# EAGLE schematic CombinedBackplane01 (EAGLE 7.7.0)

## Sheet 1 of 5
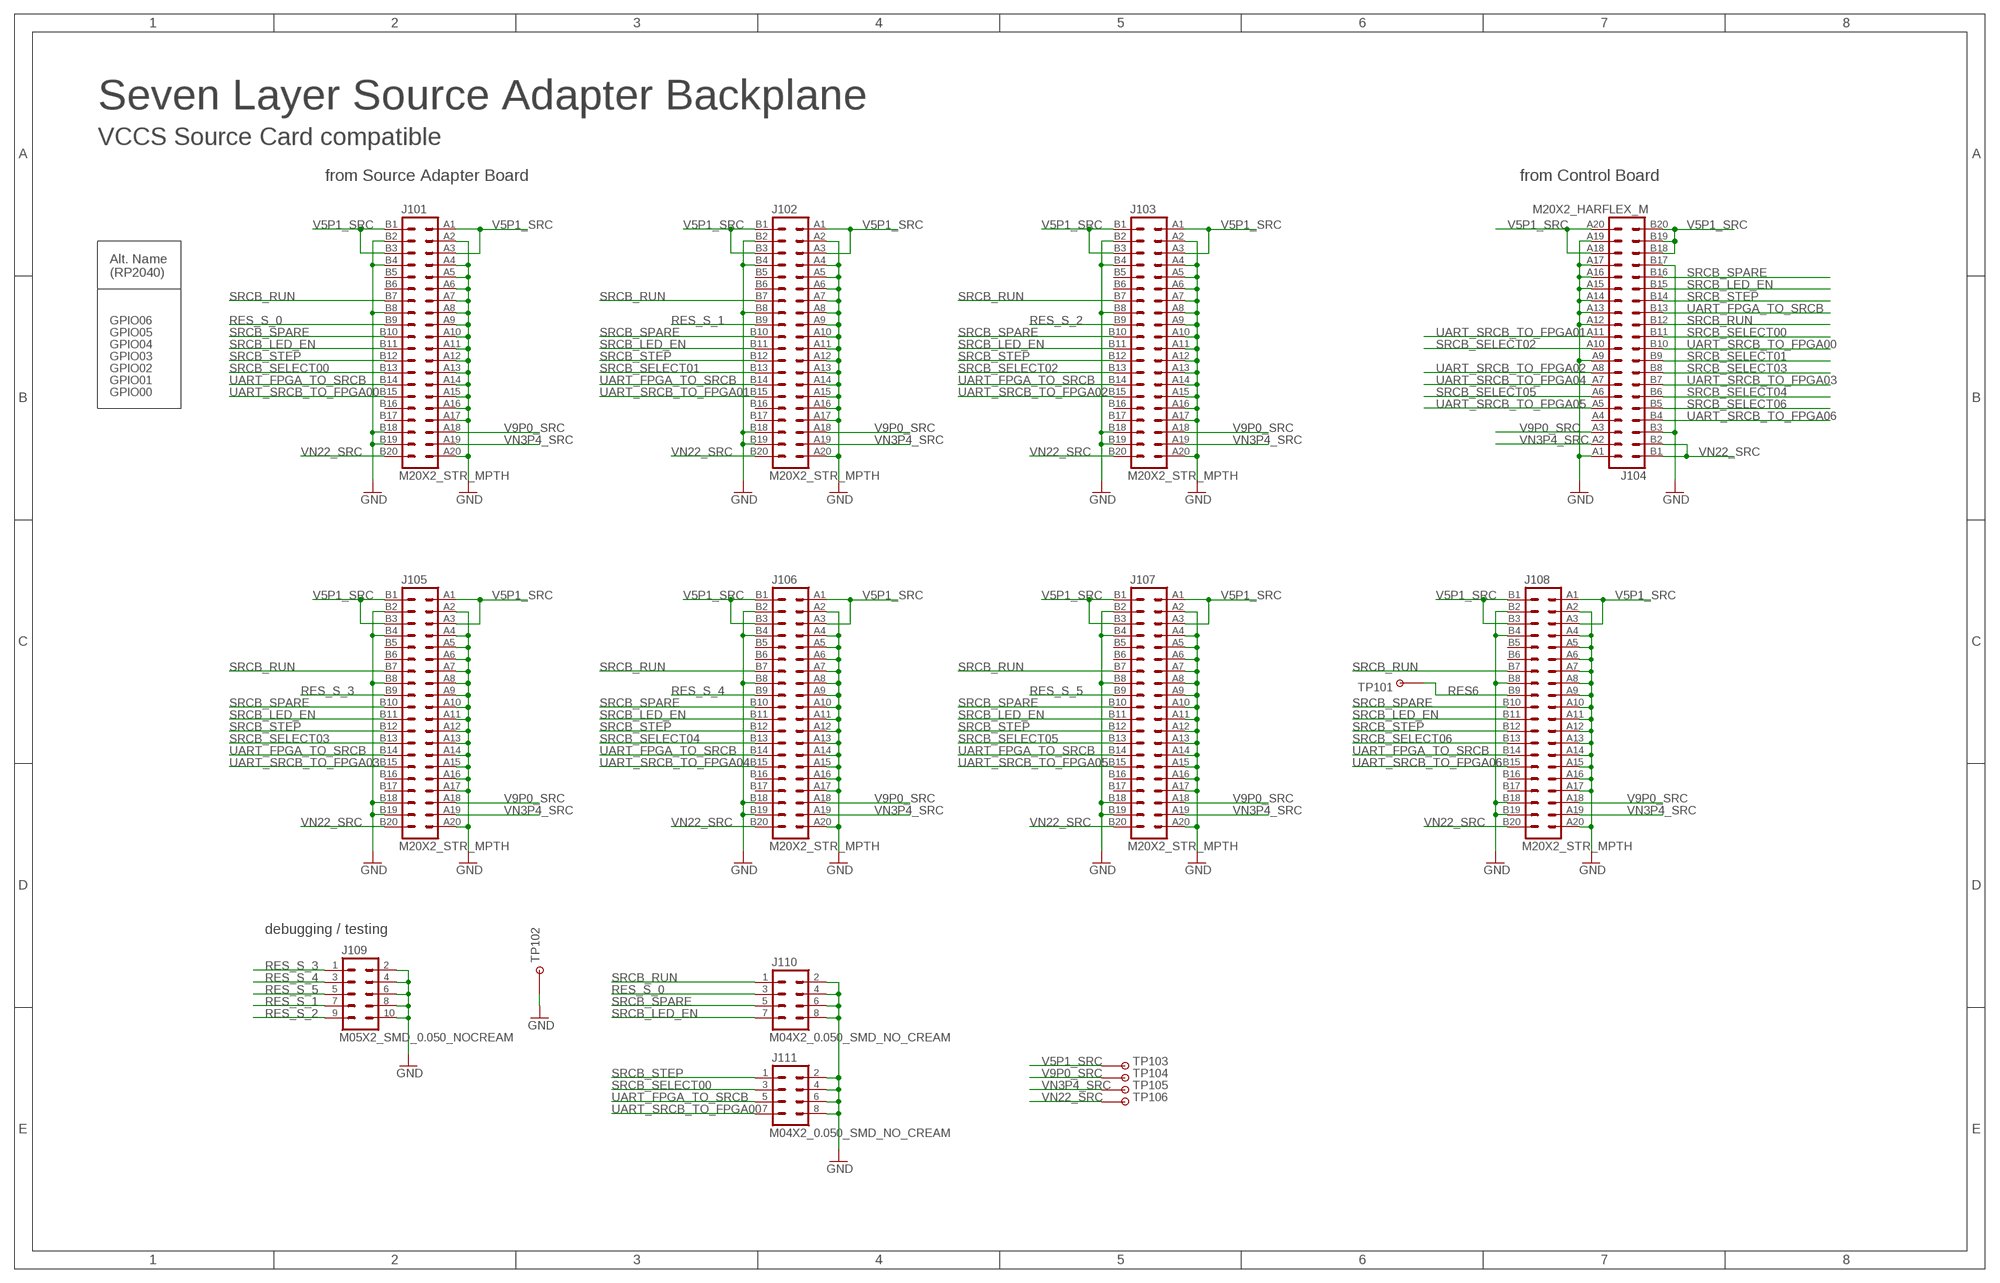
[diagram p0: schematic, sheet 1]

### Parts
J101  M20X2_STR_MPTH  [M20X2_HARFLEX_F_STR_MPTH]
J102  M20X2_STR_MPTH  [M20X2_HARFLEX_F_STR_MPTH]
J103  M20X2_STR_MPTH  [M20X2_HARFLEX_F_STR_MPTH]
J104  M20X2_HARFLEX_M  [M20X2_HARFLEX_M]
J105  M20X2_STR_MPTH  [M20X2_HARFLEX_F_STR_MPTH]
J106  M20X2_STR_MPTH  [M20X2_HARFLEX_F_STR_MPTH]
J107  M20X2_STR_MPTH  [M20X2_HARFLEX_F_STR_MPTH]
J108  M20X2_STR_MPTH  [M20X2_HARFLEX_F_STR_MPTH]
J109  M05X2_SMD_0.050_NOCREAM  [M05X2_0.050_SMD_NO_CREAM]
J110  M04X2_0.050_SMD_NO_CREAM  [M04X2_0.050_SMD_NO_CREAM]
J111  M04X2_0.050_SMD_NO_CREAM  [M04X2_0.050_SMD_NO_CREAM]
TP101  TESTPOINT_ROUND  [TESTPAD_ROUND]
TP102  TESTPOINTTUR  [TURRET]
TP103  TESTPOINT_ROUND  [TESTPAD_ROUND]
TP104  TESTPOINT_ROUND  [TESTPAD_ROUND]
TP105  TESTPOINT_ROUND  [TESTPAD_ROUND]
TP106  TESTPOINT_ROUND  [TESTPAD_ROUND]

### Nets
GND_SRC: J101.A2 J101.A4 J101.A5 J101.A6 J101.A7 J101.A8 J101.A9 J101.A10 J101.A11 J101.A12 J101.A13 J101.A14 J101.A15 J101.A16 J101.A17 J101.A20 J101.B2 J101.B4 J101.B8 J101.B18 J101.B19 J102.A2 J102.A4 J102.A5 J102.A6 J102.A7 J102.A8 J102.A9 J102.A10 J102.A11 J102.A12 J102.A13 J102.A14 J102.A15 J102.A16 J102.A17 J102.A20 J102.B2 J102.B4 J102.B8 J102.B18 J102.B19 J103.A2 J103.A4 J103.A5 J103.A6 J103.A7 J103.A8 J103.A9 J103.A10 J103.A11 J103.A12 J103.A13 J103.A14 J103.A15 J103.A16 J103.A17 J103.A20 J103.B2 J103.B4 J103.B8 J103.B18 J103.B19 J104.A1 J104.A9 J104.A12 J104.A13 J104.A14 J104.A15 J104.A16 J104.A17 J104.A19 J104.B3 J104.B17 J105.A2 J105.A4 J105.A5 J105.A6 J105.A7 J105.A8 J105.A9 J105.A10 J105.A11 J105.A12 J105.A13 J105.A14 J105.A15 J105.A16 J105.A17 J105.A20 J105.B2 J105.B4 J105.B8 J105.B18 J105.B19 J106.A2 J106.A4 J106.A5 J106.A6 J106.A7 J106.A8 J106.A9 J106.A10 J106.A11 J106.A12 J106.A13 J106.A14 J106.A15 J106.A16 J106.A17 J106.A20 J106.B2 J106.B4 J106.B8 J106.B18 J106.B19 J107.A2 J107.A4 J107.A5 J107.A6 J107.A7 J107.A8 J107.A9 J107.A10 J107.A11 J107.A12 J107.A13 J107.A14 J107.A15 J107.A16 J107.A17 J107.A20 J107.B2 J107.B4 J107.B8 J107.B18 J107.B19 J108.A2 J108.A4 J108.A5 J108.A6 J108.A7 J108.A8 J108.A9 J108.A10 J108.A11 J108.A12 J108.A13 J108.A14 J108.A15 J108.A16 J108.A17 J108.A20 J108.B2 J108.B4 J108.B8 J108.B18 J108.B19 J109.2 J109.4 J109.6 J109.8 J109.10 J110.2 J110.4 J110.6 J110.8 J111.2 J111.4 J111.6 J111.8 TP102.P$1 ; supply symbol labelled GND
RES6: J108.B9 TP101.P$1
RES_S_0: J101.B9 J110.3
RES_S_1: J102.B9 J109.7
RES_S_2: J103.B9 J109.9
RES_S_3: J105.B9 J109.1
RES_S_4: J106.B9 J109.3
RES_S_5: J107.B9 J109.5
SRCB_LED_EN: J101.B11 J102.B11 J103.B11 J104.B15 J105.B11 J106.B11 J107.B11 J108.B11 J110.7
SRCB_RUN: J101.B7 J102.B7 J103.B7 J104.B12 J105.B7 J106.B7 J107.B7 J108.B7 J110.1
SRCB_SELECT00: J101.B13 J104.B11 J111.3
SRCB_SELECT01: J102.B13 J104.B9
SRCB_SELECT02: J103.B13 J104.A10
SRCB_SELECT03: J104.B8 J105.B13
SRCB_SELECT04: J104.B6 J106.B13
SRCB_SELECT05: J104.A6 J107.B13
SRCB_SELECT06: J104.B5 J108.B13
SRCB_SPARE: J101.B10 J102.B10 J103.B10 J104.B16 J105.B10 J106.B10 J107.B10 J108.B10 J110.5
SRCB_STEP: J101.B12 J102.B12 J103.B12 J104.B14 J105.B12 J106.B12 J107.B12 J108.B12 J111.1
UART_FPGA_TO_SRCB: J101.B14 J102.B14 J103.B14 J104.B13 J105.B14 J106.B14 J107.B14 J108.B14 J111.5
UART_SRCB_TO_FPGA00: J101.B15 J104.B10 J111.7
UART_SRCB_TO_FPGA01: J102.B15 J104.A11
UART_SRCB_TO_FPGA02: J103.B15 J104.A8
UART_SRCB_TO_FPGA03: J104.B7 J105.B15
UART_SRCB_TO_FPGA04: J104.A7 J106.B15
UART_SRCB_TO_FPGA05: J104.A5 J107.B15
UART_SRCB_TO_FPGA06: J104.B4 J108.B15
V5P1_SRC: J101.A1 J101.A3 J101.B1 J101.B3 J102.A1 J102.A3 J102.B1 J102.B3 J103.A1 J103.A3 J103.B1 J103.B3 J104.A18 J104.A20 J104.B18 J104.B19 J104.B20 J105.A1 J105.A3 J105.B1 J105.B3 J106.A1 J106.A3 J106.B1 J106.B3 J107.A1 J107.A3 J107.B1 J107.B3 J108.A1 J108.A3 J108.B1 J108.B3 TP103.P$1
V9P0_SRC: J101.A18 J102.A18 J103.A18 J104.A3 J105.A18 J106.A18 J107.A18 J108.A18 TP104.P$1
VN3P4_SRC: J101.A19 J102.A19 J103.A19 J104.A2 J105.A19 J106.A19 J107.A19 J108.A19 TP105.P$1
VN22_SRC: J101.B20 J102.B20 J103.B20 J104.B1 J104.B2 J105.B20 J106.B20 J107.B20 J108.B20 TP106.P$1
Unconnected: J101.B5 J101.B6 J101.B16 J101.B17 J102.B5 J102.B6 J102.B16 J102.B17 J103.B5 J103.B6 J103.B16 J103.B17 J104.A4 J105.B5 J105.B6 J105.B16 J105.B17 J106.B5 J106.B6 J106.B16 J106.B17 J107.B5 J107.B6 J107.B16 J107.B17 J108.B5 J108.B6 J108.B16 J108.B17

### Notes on the sheet
- Seven Layer Source Adapter Backplane
- VCCS Source Card compatible
- from Source Adapter Board | from Control Board
- Alt. Name
  (RP2040)
- GPIO06
- GPIO05
- GPIO04
- GPIO03
- GPIO02
- GPIO01
- GPIO00
- debugging / testing

## Sheet 2 of 5
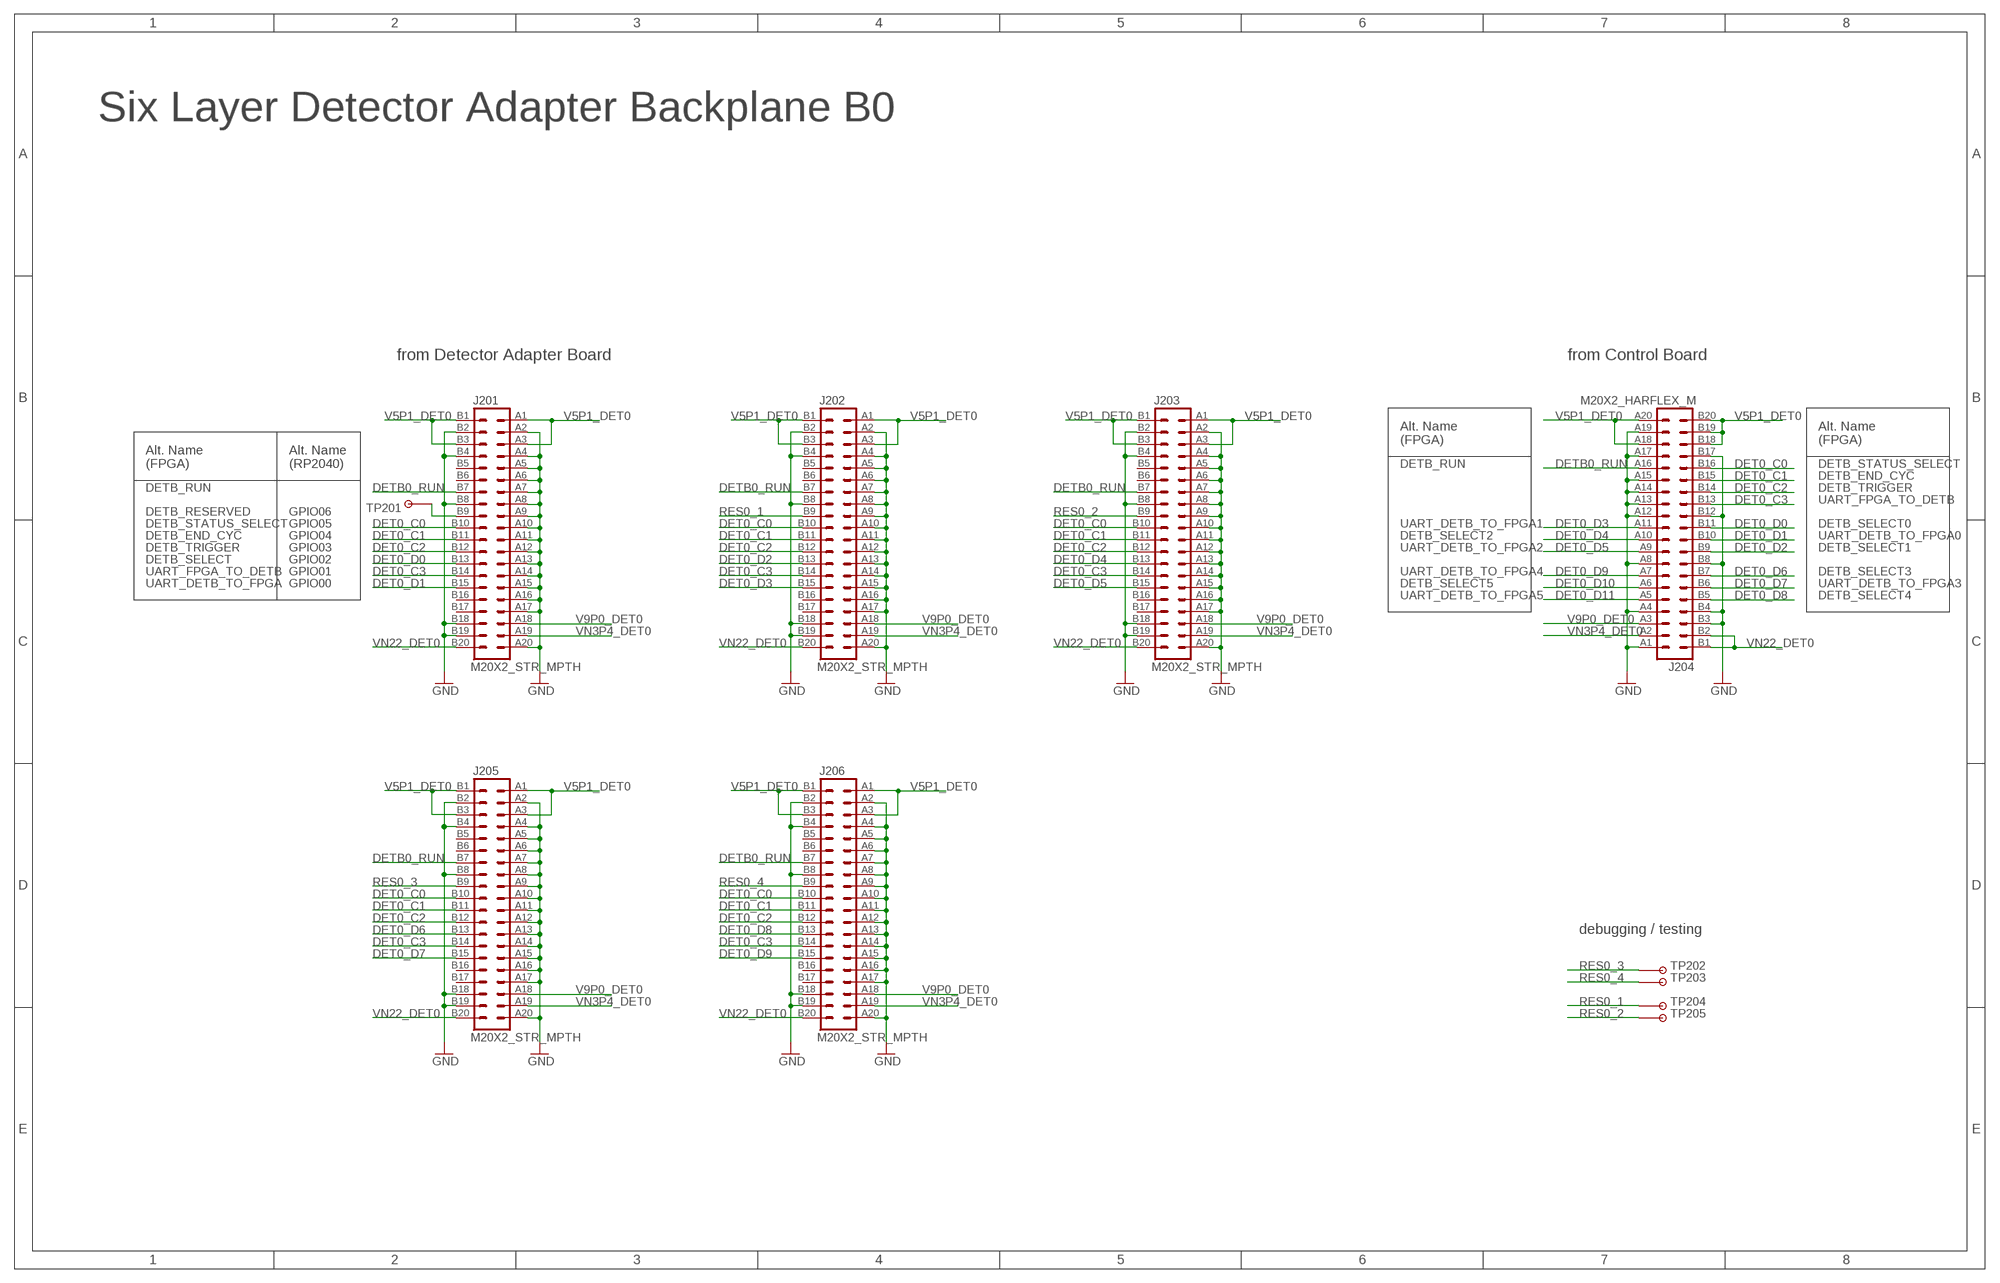
[diagram p1: schematic, sheet 2]

### Parts
J201  M20X2_STR_MPTH  [M20X2_HARFLEX_F_STR_MPTH]
J202  M20X2_STR_MPTH  [M20X2_HARFLEX_F_STR_MPTH]
J203  M20X2_STR_MPTH  [M20X2_HARFLEX_F_STR_MPTH]
J204  M20X2_HARFLEX_M  [M20X2_HARFLEX_M]
J205  M20X2_STR_MPTH  [M20X2_HARFLEX_F_STR_MPTH]
J206  M20X2_STR_MPTH  [M20X2_HARFLEX_F_STR_MPTH]
TP201  TESTPOINT_ROUND  [TESTPAD_ROUND]
TP202  TESTPOINT_ROUND  [TESTPAD_ROUND]
TP203  TESTPOINT_ROUND  [TESTPAD_ROUND]
TP204  TESTPOINT_ROUND  [TESTPAD_ROUND]
TP205  TESTPOINT_ROUND  [TESTPAD_ROUND]

### Nets
DET0_C0: J201.B10 J202.B10 J203.B10 J204.B16 J205.B10 J206.B10
DET0_C1: J201.B11 J202.B11 J203.B11 J204.B15 J205.B11 J206.B11
DET0_C2: J201.B12 J202.B12 J203.B12 J204.B14 J205.B12 J206.B12
DET0_C3: J201.B14 J202.B14 J203.B14 J204.B13 J205.B14 J206.B14
DET0_D0: J201.B13 J204.B11
DET0_D1: J201.B15 J204.B10
DET0_D2: J202.B13 J204.B9
DET0_D3: J202.B15 J204.A11
DET0_D4: J203.B13 J204.A10
DET0_D5: J203.B15 J204.A9
DET0_D6: J204.B7 J205.B13
DET0_D7: J204.B6 J205.B15
DET0_D8: J204.B5 J206.B13
DET0_D9: J204.A7 J206.B15
DET0_D10: J204.A6
DET0_D11: J204.A5
DETB0_RUN: J201.B7 J202.B7 J203.B7 J204.A16 J205.B7 J206.B7
GND: J201.A2 J201.A4 J201.A5 J201.A6 J201.A7 J201.A8 J201.A9 J201.A10 J201.A11 J201.A12 J201.A13 J201.A14 J201.A15 J201.A16 J201.A17 J201.A20 J201.B2 J201.B4 J201.B8 J201.B18 J201.B19 J202.A2 J202.A4 J202.A5 J202.A6 J202.A7 J202.A8 J202.A9 J202.A10 J202.A11 J202.A12 J202.A13 J202.A14 J202.A15 J202.A16 J202.A17 J202.A20 J202.B2 J202.B4 J202.B8 J202.B18 J202.B19 J203.A2 J203.A4 J203.A5 J203.A6 J203.A7 J203.A8 J203.A9 J203.A10 J203.A11 J203.A12 J203.A13 J203.A14 J203.A15 J203.A16 J203.A17 J203.A20 J203.B2 J203.B4 J203.B8 J203.B18 J203.B19 J204.A1 J204.A4 J204.A8 J204.A12 J204.A13 J204.A14 J204.A15 J204.A17 J204.A19 J204.B3 J204.B4 J204.B8 J204.B12 J204.B17 J205.A2 J205.A4 J205.A5 J205.A6 J205.A7 J205.A8 J205.A9 J205.A10 J205.A11 J205.A12 J205.A13 J205.A14 J205.A15 J205.A16 J205.A17 J205.A20 J205.B2 J205.B4 J205.B8 J205.B18 J205.B19 J206.A2 J206.A4 J206.A5 J206.A6 J206.A7 J206.A8 J206.A9 J206.A10 J206.A11 J206.A12 J206.A13 J206.A14 J206.A15 J206.A16 J206.A17 J206.A20 J206.B2 J206.B4 J206.B8 J206.B18 J206.B19 ; also sheet 3,4,5
N$2: J201.B9 TP201.P$1
RES0_1: J202.B9 TP204.P$1
RES0_2: J203.B9 TP205.P$1
RES0_3: J205.B9 TP202.P$1
RES0_4: J206.B9 TP203.P$1
V5P1_DET0: J201.A1 J201.A3 J201.B1 J201.B3 J202.A1 J202.A3 J202.B1 J202.B3 J203.A1 J203.A3 J203.B1 J203.B3 J204.A18 J204.A20 J204.B18 J204.B19 J204.B20 J205.A1 J205.A3 J205.B1 J205.B3 J206.A1 J206.A3 J206.B1 J206.B3
V9P0_DET0: J201.A18 J202.A18 J203.A18 J204.A3 J205.A18 J206.A18
VN3P4_DET0: J201.A19 J202.A19 J203.A19 J204.A2 J205.A19 J206.A19
VN22_DET0: J201.B20 J202.B20 J203.B20 J204.B1 J204.B2 J205.B20 J206.B20
Unconnected: J201.B5 J201.B6 J201.B16 J201.B17 J202.B5 J202.B6 J202.B16 J202.B17 J203.B5 J203.B6 J203.B16 J203.B17 J205.B5 J205.B6 J205.B16 J205.B17 J206.B5 J206.B6 J206.B16 J206.B17

### Notes on the sheet
- Six Layer Detector Adapter Backplane B0
- from Detector Adapter Board | from Control Board
- Alt. Name
  (FPGA)
- Alt. Name
  (FPGA)
- Alt. Name
  (FPGA)
- Alt. Name
  (RP2040)
- DETB_RUN | DETB_STATUS_SELECT
- DETB_END_CYC
- DETB_RUN | DETB_TRIGGER
- UART_FPGA_TO_DETB
- DETB_RESERVED | GPIO06
- DETB_STATUS_SELECT | GPIO05 | UART_DETB_TO_FPGA1 | DETB_SELECT0
- DETB_END_CYC | GPIO04 | DETB_SELECT2 | UART_DETB_TO_FPGA0
- DETB_TRIGGER | GPIO03 | UART_DETB_TO_FPGA2 | DETB_SELECT1
- DETB_SELECT | GPIO02
- UART_FPGA_TO_DETB | GPIO01 | UART_DETB_TO_FPGA4 | DETB_SELECT3
- UART_DETB_TO_FPGA | GPIO00 | DETB_SELECT5 | UART_DETB_TO_FPGA3
- UART_DETB_TO_FPGA5 | DETB_SELECT4
- debugging / testing

## Sheet 3 of 5
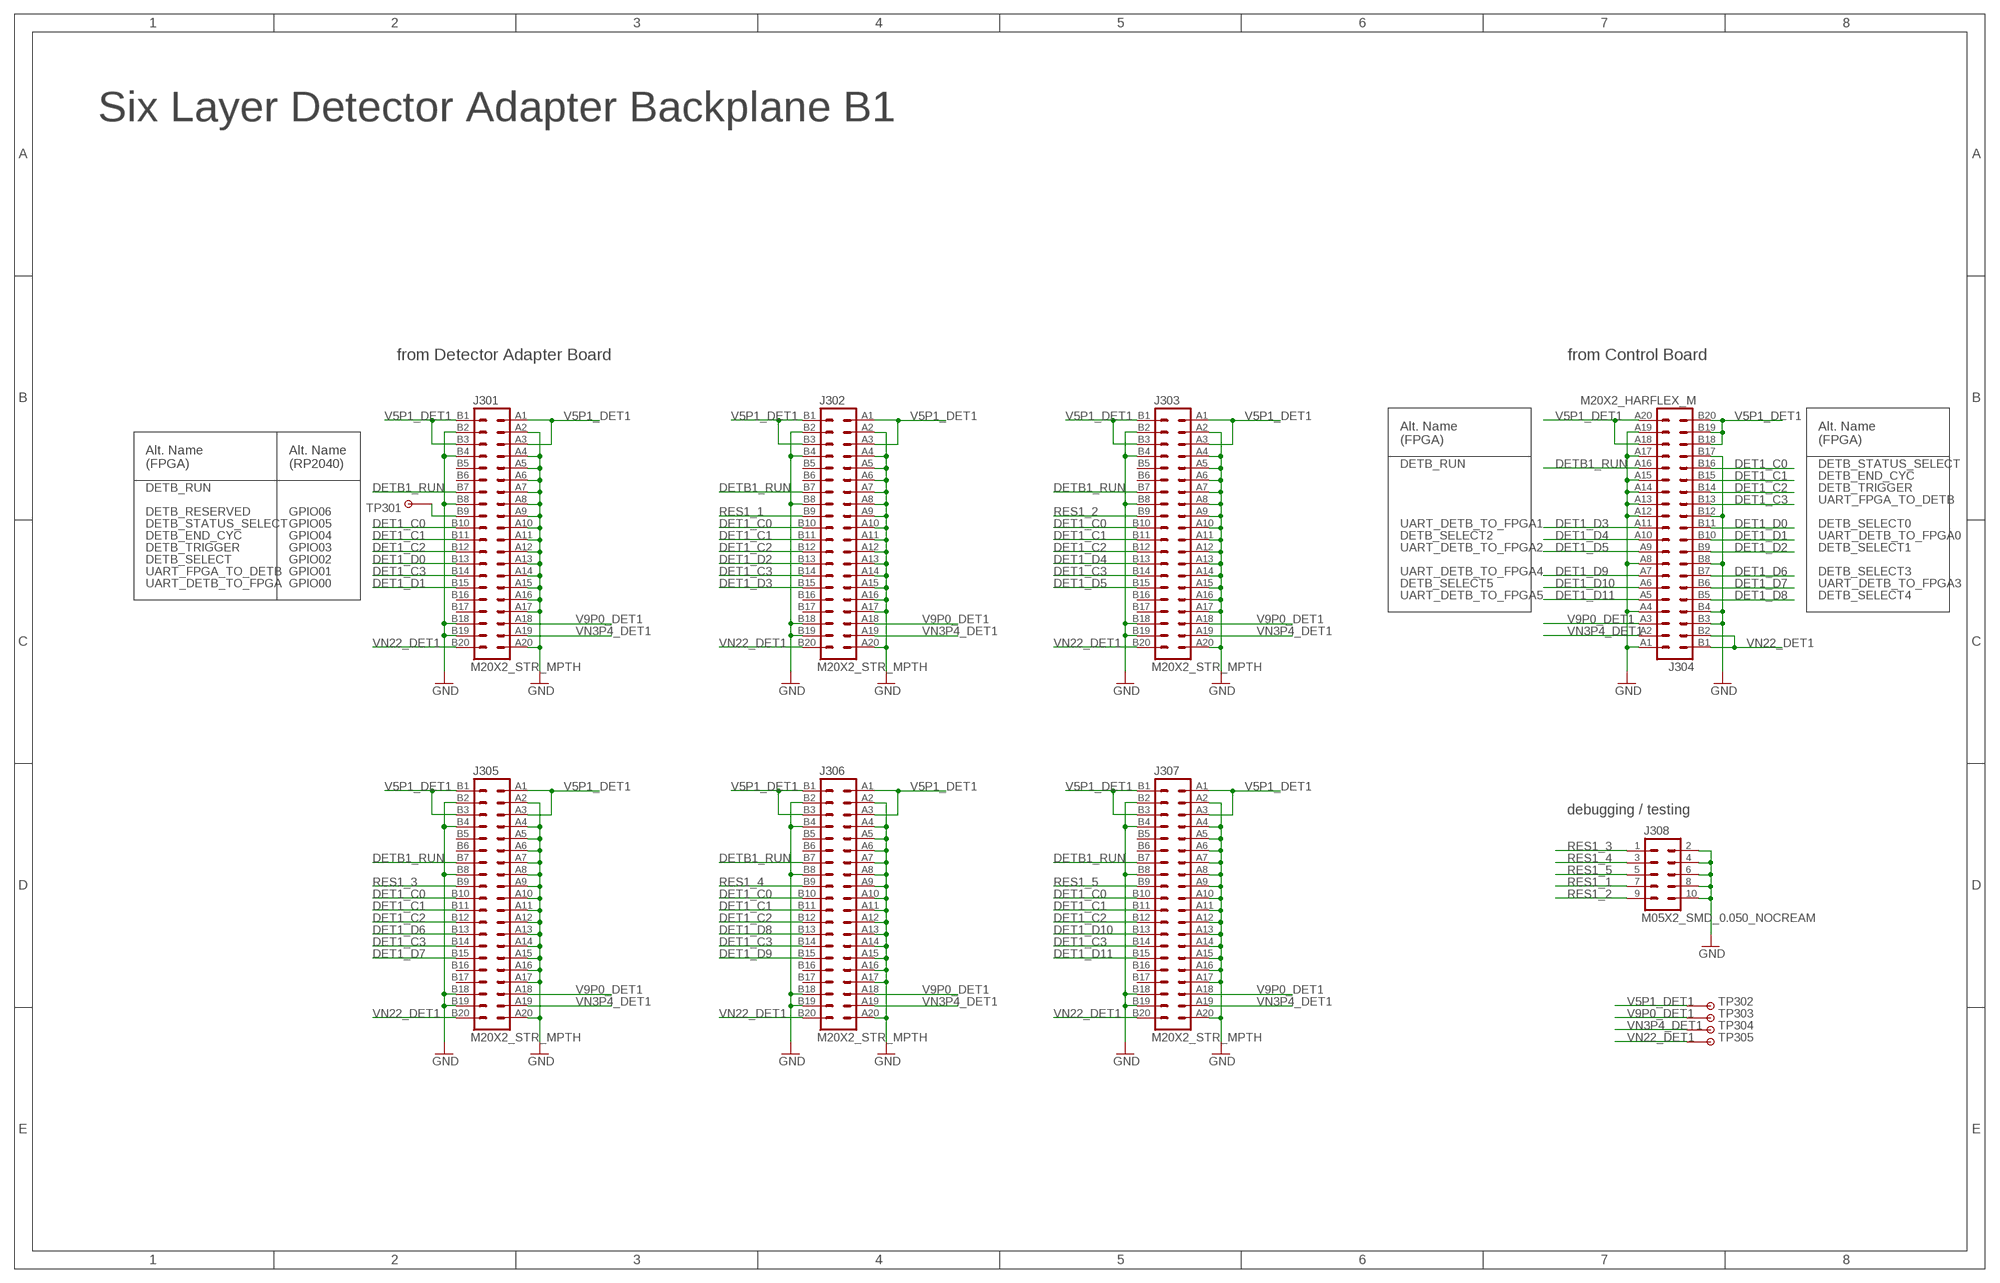
[diagram p2: schematic, sheet 3]

### Parts
J301  M20X2_STR_MPTH  [M20X2_HARFLEX_F_STR_MPTH]
J302  M20X2_STR_MPTH  [M20X2_HARFLEX_F_STR_MPTH]
J303  M20X2_STR_MPTH  [M20X2_HARFLEX_F_STR_MPTH]
J304  M20X2_HARFLEX_M  [M20X2_HARFLEX_M]
J305  M20X2_STR_MPTH  [M20X2_HARFLEX_F_STR_MPTH]
J306  M20X2_STR_MPTH  [M20X2_HARFLEX_F_STR_MPTH]
J307  M20X2_STR_MPTH  [M20X2_HARFLEX_F_STR_MPTH]
J308  M05X2_SMD_0.050_NOCREAM  [M05X2_0.050_SMD_NO_CREAM]
TP301  TESTPOINT_ROUND  [TESTPAD_ROUND]
TP302  TESTPOINT_ROUND  [TESTPAD_ROUND]
TP303  TESTPOINT_ROUND  [TESTPAD_ROUND]
TP304  TESTPOINT_ROUND  [TESTPAD_ROUND]
TP305  TESTPOINT_ROUND  [TESTPAD_ROUND]

### Nets
DET1_C0: J301.B10 J302.B10 J303.B10 J304.B16 J305.B10 J306.B10 J307.B10
DET1_C1: J301.B11 J302.B11 J303.B11 J304.B15 J305.B11 J306.B11 J307.B11
DET1_C2: J301.B12 J302.B12 J303.B12 J304.B14 J305.B12 J306.B12 J307.B12
DET1_C3: J301.B14 J302.B14 J303.B14 J304.B13 J305.B14 J306.B14 J307.B14
DET1_D0: J301.B13 J304.B11
DET1_D1: J301.B15 J304.B10
DET1_D2: J302.B13 J304.B9
DET1_D3: J302.B15 J304.A11
DET1_D4: J303.B13 J304.A10
DET1_D5: J303.B15 J304.A9
DET1_D6: J304.B7 J305.B13
DET1_D7: J304.B6 J305.B15
DET1_D8: J304.B5 J306.B13
DET1_D9: J304.A7 J306.B15
DET1_D10: J304.A6 J307.B13
DET1_D11: J304.A5 J307.B15
DETB1_RUN: J301.B7 J302.B7 J303.B7 J304.A16 J305.B7 J306.B7 J307.B7
GND: J301.A2 J301.A4 J301.A5 J301.A6 J301.A7 J301.A8 J301.A9 J301.A10 J301.A11 J301.A12 J301.A13 J301.A14 J301.A15 J301.A16 J301.A17 J301.A20 J301.B2 J301.B4 J301.B8 J301.B18 J301.B19 J302.A2 J302.A4 J302.A5 J302.A6 J302.A7 J302.A8 J302.A9 J302.A10 J302.A11 J302.A12 J302.A13 J302.A14 J302.A15 J302.A16 J302.A17 J302.A20 J302.B2 J302.B4 J302.B8 J302.B18 J302.B19 J303.A2 J303.A4 J303.A5 J303.A6 J303.A7 J303.A8 J303.A9 J303.A10 J303.A11 J303.A12 J303.A13 J303.A14 J303.A15 J303.A16 J303.A17 J303.A20 J303.B2 J303.B4 J303.B8 J303.B18 J303.B19 J304.A1 J304.A4 J304.A8 J304.A12 J304.A13 J304.A14 J304.A15 J304.A17 J304.A19 J304.B3 J304.B4 J304.B8 J304.B12 J304.B17 J305.A2 J305.A4 J305.A5 J305.A6 J305.A7 J305.A8 J305.A9 J305.A10 J305.A11 J305.A12 J305.A13 J305.A14 J305.A15 J305.A16 J305.A17 J305.A20 J305.B2 J305.B4 J305.B8 J305.B18 J305.B19 J306.A2 J306.A4 J306.A5 J306.A6 J306.A7 J306.A8 J306.A9 J306.A10 J306.A11 J306.A12 J306.A13 J306.A14 J306.A15 J306.A16 J306.A17 J306.A20 J306.B2 J306.B4 J306.B8 J306.B18 J306.B19 J307.A2 J307.A4 J307.A5 J307.A6 J307.A7 J307.A8 J307.A9 J307.A10 J307.A11 J307.A12 J307.A13 J307.A14 J307.A15 J307.A16 J307.A17 J307.A20 J307.B2 J307.B4 J307.B8 J307.B18 J307.B19 J308.2 J308.4 J308.6 J308.8 J308.10 ; also sheet 2,4,5
N$3: J301.B9 TP301.P$1
RES1_1: J302.B9 J308.7
RES1_2: J303.B9 J308.9
RES1_3: J305.B9 J308.1
RES1_4: J306.B9 J308.3
RES1_5: J307.B9 J308.5
V5P1_DET1: J301.A1 J301.A3 J301.B1 J301.B3 J302.A1 J302.A3 J302.B1 J302.B3 J303.A1 J303.A3 J303.B1 J303.B3 J304.A18 J304.A20 J304.B18 J304.B19 J304.B20 J305.A1 J305.A3 J305.B1 J305.B3 J306.A1 J306.A3 J306.B1 J306.B3 J307.A1 J307.A3 J307.B1 J307.B3 TP302.P$1
V9P0_DET1: J301.A18 J302.A18 J303.A18 J304.A3 J305.A18 J306.A18 J307.A18 TP303.P$1
VN3P4_DET1: J301.A19 J302.A19 J303.A19 J304.A2 J305.A19 J306.A19 J307.A19 TP304.P$1
VN22_DET1: J301.B20 J302.B20 J303.B20 J304.B1 J304.B2 J305.B20 J306.B20 J307.B20 TP305.P$1
Unconnected: J301.B5 J301.B6 J301.B16 J301.B17 J302.B5 J302.B6 J302.B16 J302.B17 J303.B5 J303.B6 J303.B16 J303.B17 J305.B5 J305.B6 J305.B16 J305.B17 J306.B5 J306.B6 J306.B16 J306.B17 J307.B5 J307.B6 J307.B16 J307.B17

### Notes on the sheet
- Six Layer Detector Adapter Backplane B1
- from Detector Adapter Board | from Control Board
- Alt. Name
  (FPGA)
- Alt. Name
  (FPGA)
- Alt. Name
  (FPGA)
- Alt. Name
  (RP2040)
- DETB_RUN | DETB_STATUS_SELECT
- DETB_END_CYC
- DETB_RUN | DETB_TRIGGER
- UART_FPGA_TO_DETB
- DETB_RESERVED | GPIO06
- DETB_STATUS_SELECT | GPIO05 | UART_DETB_TO_FPGA1 | DETB_SELECT0
- DETB_END_CYC | GPIO04 | DETB_SELECT2 | UART_DETB_TO_FPGA0
- DETB_TRIGGER | GPIO03 | UART_DETB_TO_FPGA2 | DETB_SELECT1
- DETB_SELECT | GPIO02
- UART_FPGA_TO_DETB | GPIO01 | UART_DETB_TO_FPGA4 | DETB_SELECT3
- UART_DETB_TO_FPGA | GPIO00 | DETB_SELECT5 | UART_DETB_TO_FPGA3
- UART_DETB_TO_FPGA5 | DETB_SELECT4
- debugging / testing

## Sheet 4 of 5
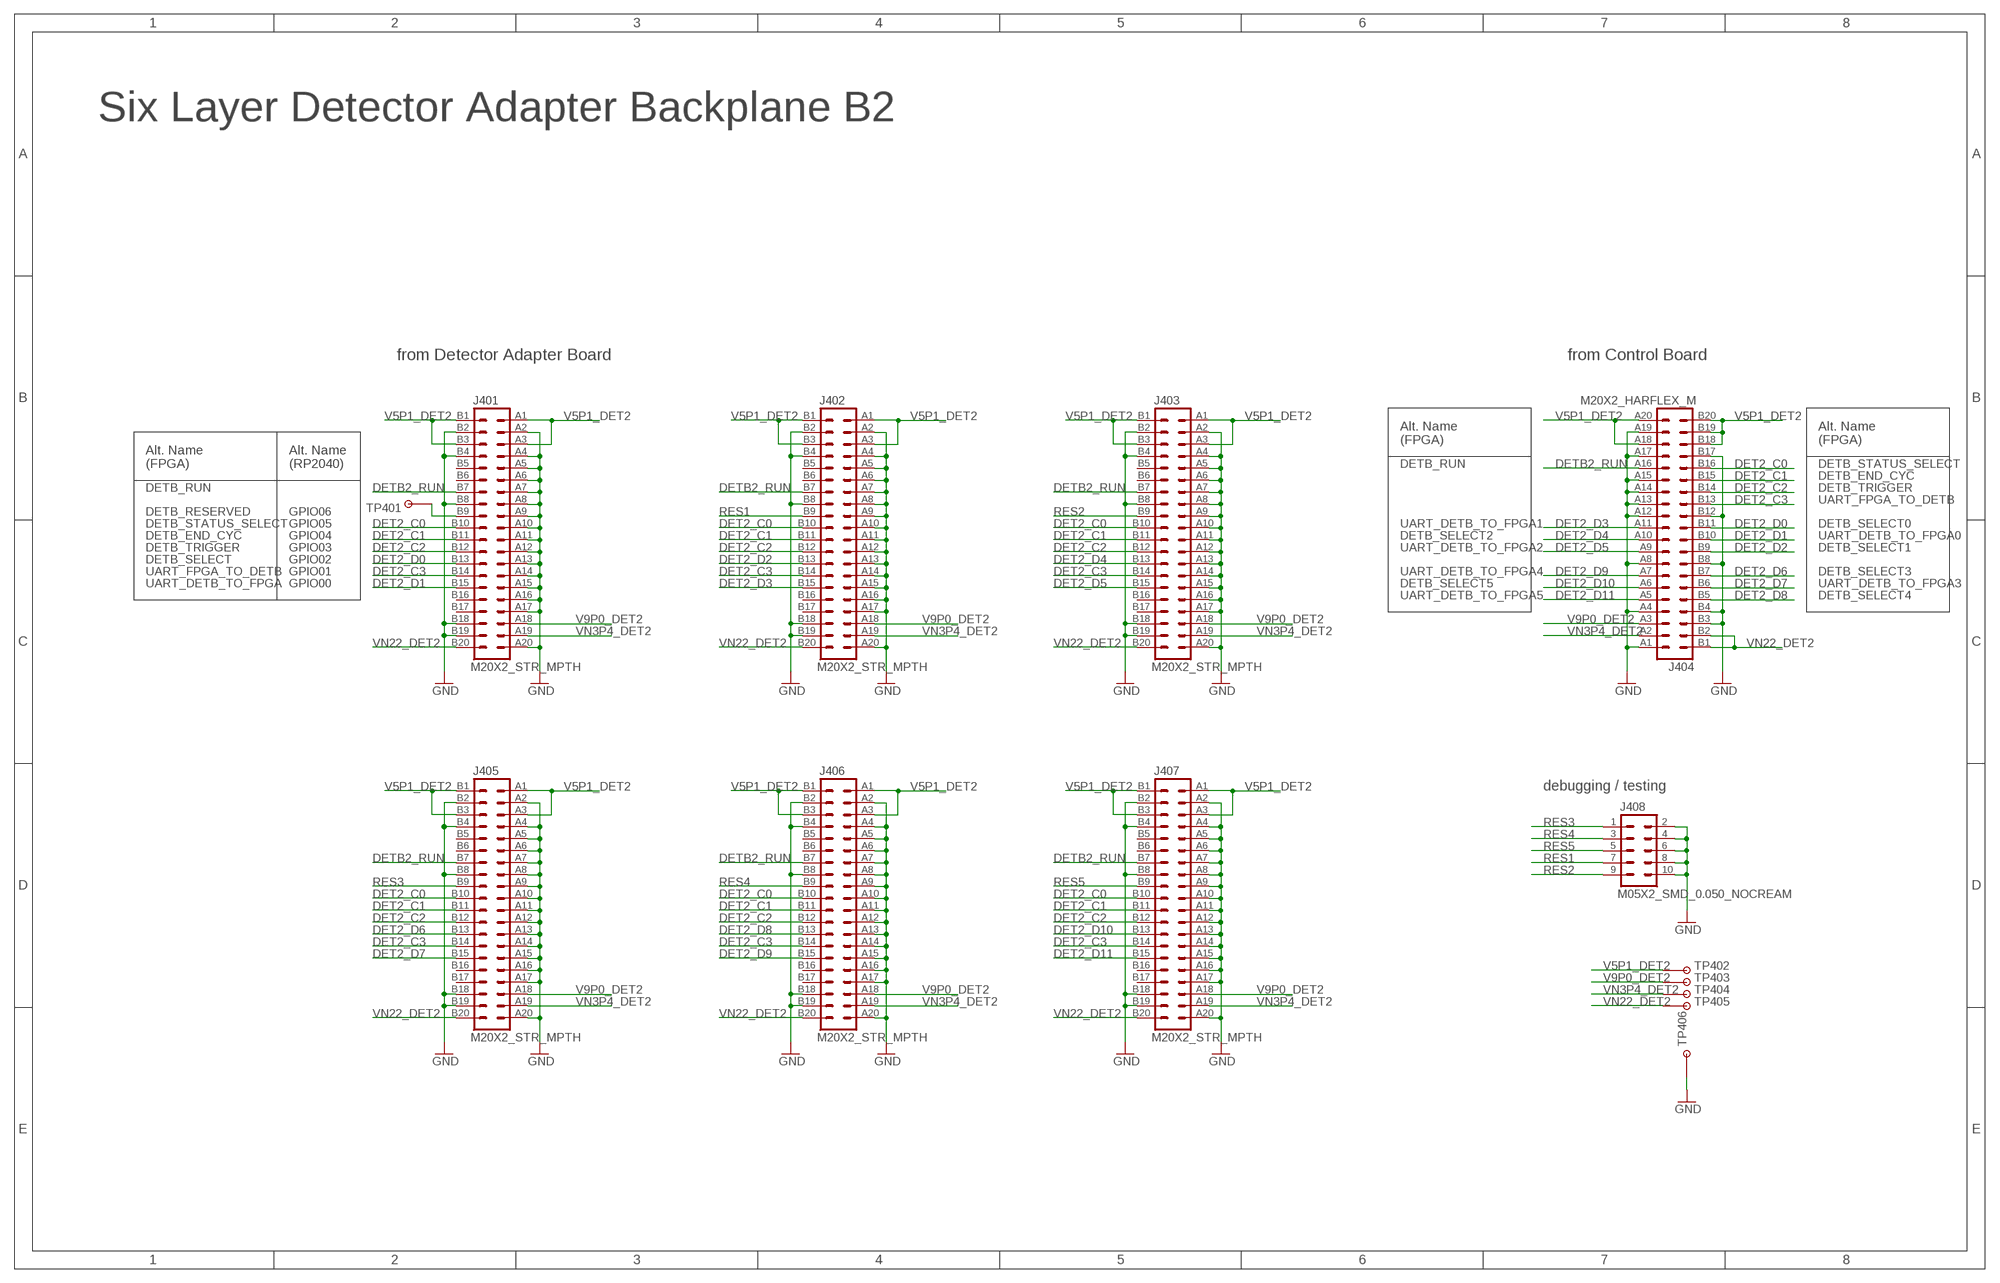
[diagram p3: schematic, sheet 4]

### Parts
J401  M20X2_STR_MPTH  [M20X2_HARFLEX_F_STR_MPTH]
J402  M20X2_STR_MPTH  [M20X2_HARFLEX_F_STR_MPTH]
J403  M20X2_STR_MPTH  [M20X2_HARFLEX_F_STR_MPTH]
J404  M20X2_HARFLEX_M  [M20X2_HARFLEX_M]
J405  M20X2_STR_MPTH  [M20X2_HARFLEX_F_STR_MPTH]
J406  M20X2_STR_MPTH  [M20X2_HARFLEX_F_STR_MPTH]
J407  M20X2_STR_MPTH  [M20X2_HARFLEX_F_STR_MPTH]
J408  M05X2_SMD_0.050_NOCREAM  [M05X2_0.050_SMD_NO_CREAM]
TP401  TESTPOINT_ROUND  [TESTPAD_ROUND]
TP402  TESTPOINT_ROUND  [TESTPAD_ROUND]
TP403  TESTPOINT_ROUND  [TESTPAD_ROUND]
TP404  TESTPOINT_ROUND  [TESTPAD_ROUND]
TP405  TESTPOINT_ROUND  [TESTPAD_ROUND]
TP406  TESTPOINTTUR  [TURRET]

### Nets
DET2_C0: J401.B10 J402.B10 J403.B10 J404.B16 J405.B10 J406.B10 J407.B10
DET2_C1: J401.B11 J402.B11 J403.B11 J404.B15 J405.B11 J406.B11 J407.B11
DET2_C2: J401.B12 J402.B12 J403.B12 J404.B14 J405.B12 J406.B12 J407.B12
DET2_C3: J401.B14 J402.B14 J403.B14 J404.B13 J405.B14 J406.B14 J407.B14
DET2_D0: J401.B13 J404.B11
DET2_D1: J401.B15 J404.B10
DET2_D2: J402.B13 J404.B9
DET2_D3: J402.B15 J404.A11
DET2_D4: J403.B13 J404.A10
DET2_D5: J403.B15 J404.A9
DET2_D6: J404.B7 J405.B13
DET2_D7: J404.B6 J405.B15
DET2_D8: J404.B5 J406.B13
DET2_D9: J404.A7 J406.B15
DET2_D10: J404.A6 J407.B13
DET2_D11: J404.A5 J407.B15
DETB2_RUN: J401.B7 J402.B7 J403.B7 J404.A16 J405.B7 J406.B7 J407.B7
GND: J401.A2 J401.A4 J401.A5 J401.A6 J401.A7 J401.A8 J401.A9 J401.A10 J401.A11 J401.A12 J401.A13 J401.A14 J401.A15 J401.A16 J401.A17 J401.A20 J401.B2 J401.B4 J401.B8 J401.B18 J401.B19 J402.A2 J402.A4 J402.A5 J402.A6 J402.A7 J402.A8 J402.A9 J402.A10 J402.A11 J402.A12 J402.A13 J402.A14 J402.A15 J402.A16 J402.A17 J402.A20 J402.B2 J402.B4 J402.B8 J402.B18 J402.B19 J403.A2 J403.A4 J403.A5 J403.A6 J403.A7 J403.A8 J403.A9 J403.A10 J403.A11 J403.A12 J403.A13 J403.A14 J403.A15 J403.A16 J403.A17 J403.A20 J403.B2 J403.B4 J403.B8 J403.B18 J403.B19 J404.A1 J404.A4 J404.A8 J404.A12 J404.A13 J404.A14 J404.A15 J404.A17 J404.A19 J404.B3 J404.B4 J404.B8 J404.B12 J404.B17 J405.A2 J405.A4 J405.A5 J405.A6 J405.A7 J405.A8 J405.A9 J405.A10 J405.A11 J405.A12 J405.A13 J405.A14 J405.A15 J405.A16 J405.A17 J405.A20 J405.B2 J405.B4 J405.B8 J405.B18 J405.B19 J406.A2 J406.A4 J406.A5 J406.A6 J406.A7 J406.A8 J406.A9 J406.A10 J406.A11 J406.A12 J406.A13 J406.A14 J406.A15 J406.A16 J406.A17 J406.A20 J406.B2 J406.B4 J406.B8 J406.B18 J406.B19 J407.A2 J407.A4 J407.A5 J407.A6 J407.A7 J407.A8 J407.A9 J407.A10 J407.A11 J407.A12 J407.A13 J407.A14 J407.A15 J407.A16 J407.A17 J407.A20 J407.B2 J407.B4 J407.B8 J407.B18 J407.B19 J408.2 J408.4 J408.6 J408.8 J408.10 TP406.P$1 ; also sheet 2,3,5
N$4: J401.B9 TP401.P$1
RES1: J402.B9 J408.7
RES2: J403.B9 J408.9
RES3: J405.B9 J408.1
RES4: J406.B9 J408.3
RES5: J407.B9 J408.5
V5P1_DET2: J401.A1 J401.A3 J401.B1 J401.B3 J402.A1 J402.A3 J402.B1 J402.B3 J403.A1 J403.A3 J403.B1 J403.B3 J404.A18 J404.A20 J404.B18 J404.B19 J404.B20 J405.A1 J405.A3 J405.B1 J405.B3 J406.A1 J406.A3 J406.B1 J406.B3 J407.A1 J407.A3 J407.B1 J407.B3 TP402.P$1
V9P0_DET2: J401.A18 J402.A18 J403.A18 J404.A3 J405.A18 J406.A18 J407.A18 TP403.P$1
VN3P4_DET2: J401.A19 J402.A19 J403.A19 J404.A2 J405.A19 J406.A19 J407.A19 TP404.P$1
VN22_DET2: J401.B20 J402.B20 J403.B20 J404.B1 J404.B2 J405.B20 J406.B20 J407.B20 TP405.P$1
Unconnected: J401.B5 J401.B6 J401.B16 J401.B17 J402.B5 J402.B6 J402.B16 J402.B17 J403.B5 J403.B6 J403.B16 J403.B17 J405.B5 J405.B6 J405.B16 J405.B17 J406.B5 J406.B6 J406.B16 J406.B17 J407.B5 J407.B6 J407.B16 J407.B17

### Notes on the sheet
- Six Layer Detector Adapter Backplane B2
- from Detector Adapter Board | from Control Board
- Alt. Name
  (FPGA)
- Alt. Name
  (FPGA)
- Alt. Name
  (FPGA)
- Alt. Name
  (RP2040)
- DETB_RUN | DETB_STATUS_SELECT
- DETB_END_CYC
- DETB_RUN | DETB_TRIGGER
- UART_FPGA_TO_DETB
- DETB_RESERVED | GPIO06
- DETB_STATUS_SELECT | GPIO05 | UART_DETB_TO_FPGA1 | DETB_SELECT0
- DETB_END_CYC | GPIO04 | DETB_SELECT2 | UART_DETB_TO_FPGA0
- DETB_TRIGGER | GPIO03 | UART_DETB_TO_FPGA2 | DETB_SELECT1
- DETB_SELECT | GPIO02
- UART_FPGA_TO_DETB | GPIO01 | UART_DETB_TO_FPGA4 | DETB_SELECT3
- UART_DETB_TO_FPGA | GPIO00 | DETB_SELECT5 | UART_DETB_TO_FPGA3
- UART_DETB_TO_FPGA5 | DETB_SELECT4
- debugging / testing

## Sheet 5 of 5
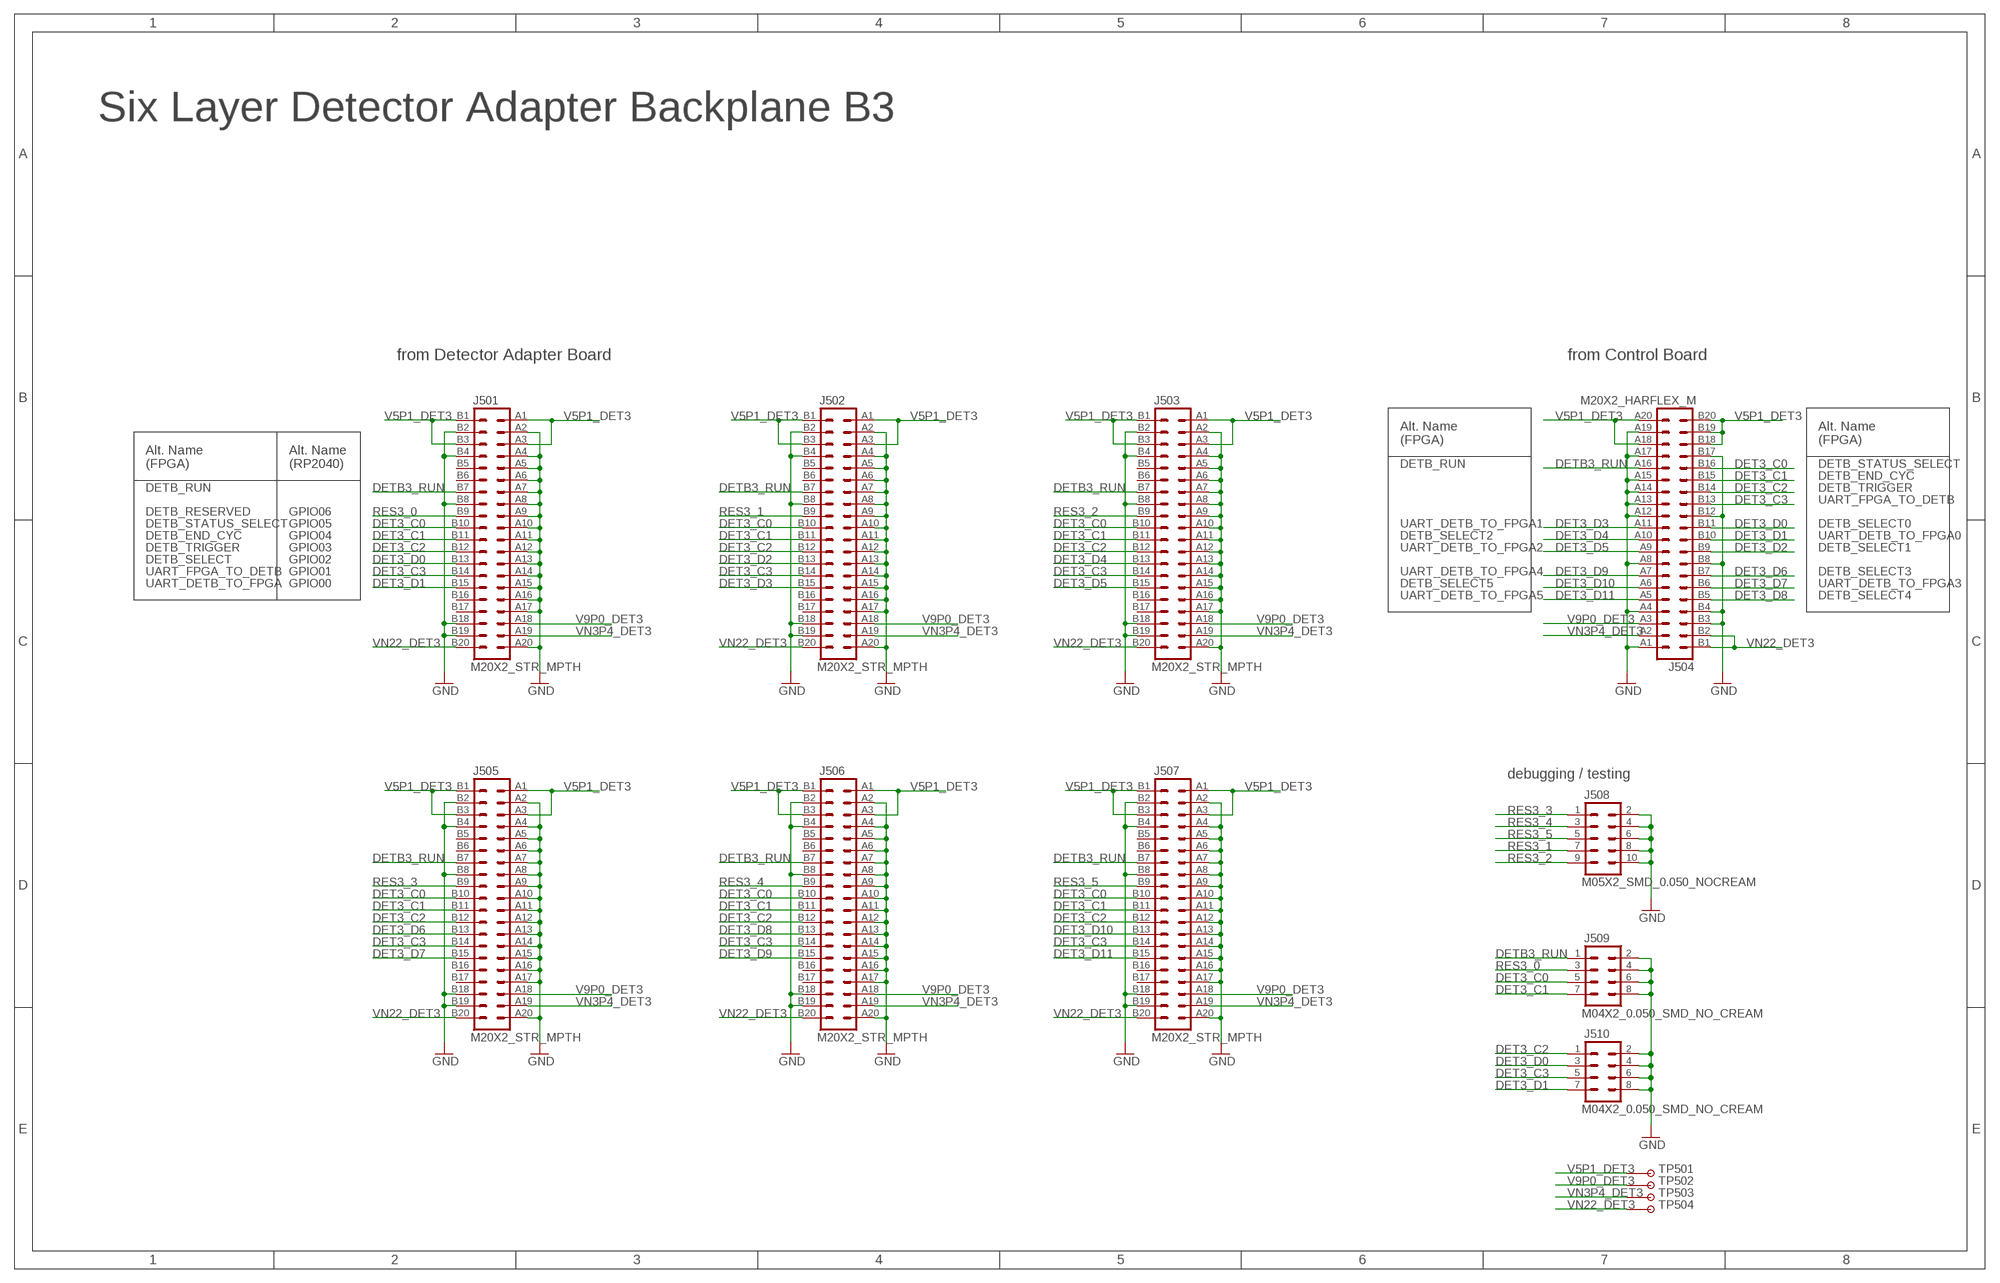
[diagram p4: schematic, sheet 5]

### Parts
J501  M20X2_STR_MPTH  [M20X2_HARFLEX_F_STR_MPTH]
J502  M20X2_STR_MPTH  [M20X2_HARFLEX_F_STR_MPTH]
J503  M20X2_STR_MPTH  [M20X2_HARFLEX_F_STR_MPTH]
J504  M20X2_HARFLEX_M  [M20X2_HARFLEX_M]
J505  M20X2_STR_MPTH  [M20X2_HARFLEX_F_STR_MPTH]
J506  M20X2_STR_MPTH  [M20X2_HARFLEX_F_STR_MPTH]
J507  M20X2_STR_MPTH  [M20X2_HARFLEX_F_STR_MPTH]
J508  M05X2_SMD_0.050_NOCREAM  [M05X2_0.050_SMD_NO_CREAM]
J509  M04X2_0.050_SMD_NO_CREAM  [M04X2_0.050_SMD_NO_CREAM]
J510  M04X2_0.050_SMD_NO_CREAM  [M04X2_0.050_SMD_NO_CREAM]
TP501  TESTPOINT_ROUND  [TESTPAD_ROUND]
TP502  TESTPOINT_ROUND  [TESTPAD_ROUND]
TP503  TESTPOINT_ROUND  [TESTPAD_ROUND]
TP504  TESTPOINT_ROUND  [TESTPAD_ROUND]

### Nets
DET3_C0: J501.B10 J502.B10 J503.B10 J504.B16 J505.B10 J506.B10 J507.B10 J509.5
DET3_C1: J501.B11 J502.B11 J503.B11 J504.B15 J505.B11 J506.B11 J507.B11 J509.7
DET3_C2: J501.B12 J502.B12 J503.B12 J504.B14 J505.B12 J506.B12 J507.B12 J510.1
DET3_C3: J501.B14 J502.B14 J503.B14 J504.B13 J505.B14 J506.B14 J507.B14 J510.5
DET3_D0: J501.B13 J504.B11 J510.3
DET3_D1: J501.B15 J504.B10 J510.7
DET3_D2: J502.B13 J504.B9
DET3_D3: J502.B15 J504.A11
DET3_D4: J503.B13 J504.A10
DET3_D5: J503.B15 J504.A9
DET3_D6: J504.B7 J505.B13
DET3_D7: J504.B6 J505.B15
DET3_D8: J504.B5 J506.B13
DET3_D9: J504.A7 J506.B15
DET3_D10: J504.A6 J507.B13
DET3_D11: J504.A5 J507.B15
DETB3_RUN: J501.B7 J502.B7 J503.B7 J504.A16 J505.B7 J506.B7 J507.B7 J509.1
GND: J501.A2 J501.A4 J501.A5 J501.A6 J501.A7 J501.A8 J501.A9 J501.A10 J501.A11 J501.A12 J501.A13 J501.A14 J501.A15 J501.A16 J501.A17 J501.A20 J501.B2 J501.B4 J501.B8 J501.B18 J501.B19 J502.A2 J502.A4 J502.A5 J502.A6 J502.A7 J502.A8 J502.A9 J502.A10 J502.A11 J502.A12 J502.A13 J502.A14 J502.A15 J502.A16 J502.A17 J502.A20 J502.B2 J502.B4 J502.B8 J502.B18 J502.B19 J503.A2 J503.A4 J503.A5 J503.A6 J503.A7 J503.A8 J503.A9 J503.A10 J503.A11 J503.A12 J503.A13 J503.A14 J503.A15 J503.A16 J503.A17 J503.A20 J503.B2 J503.B4 J503.B8 J503.B18 J503.B19 J504.A1 J504.A4 J504.A8 J504.A12 J504.A13 J504.A14 J504.A15 J504.A17 J504.A19 J504.B3 J504.B4 J504.B8 J504.B12 J504.B17 J505.A2 J505.A4 J505.A5 J505.A6 J505.A7 J505.A8 J505.A9 J505.A10 J505.A11 J505.A12 J505.A13 J505.A14 J505.A15 J505.A16 J505.A17 J505.A20 J505.B2 J505.B4 J505.B8 J505.B18 J505.B19 J506.A2 J506.A4 J506.A5 J506.A6 J506.A7 J506.A8 J506.A9 J506.A10 J506.A11 J506.A12 J506.A13 J506.A14 J506.A15 J506.A16 J506.A17 J506.A20 J506.B2 J506.B4 J506.B8 J506.B18 J506.B19 J507.A2 J507.A4 J507.A5 J507.A6 J507.A7 J507.A8 J507.A9 J507.A10 J507.A11 J507.A12 J507.A13 J507.A14 J507.A15 J507.A16 J507.A17 J507.A20 J507.B2 J507.B4 J507.B8 J507.B18 J507.B19 J508.2 J508.4 J508.6 J508.8 J508.10 J509.2 J509.4 J509.6 J509.8 J510.2 J510.4 J510.6 J510.8 ; also sheet 2,3,4
RES3_0: J501.B9 J509.3
RES3_1: J502.B9 J508.7
RES3_2: J503.B9 J508.9
RES3_3: J505.B9 J508.1
RES3_4: J506.B9 J508.3
RES3_5: J507.B9 J508.5
V5P1_DET3: J501.A1 J501.A3 J501.B1 J501.B3 J502.A1 J502.A3 J502.B1 J502.B3 J503.A1 J503.A3 J503.B1 J503.B3 J504.A18 J504.A20 J504.B18 J504.B19 J504.B20 J505.A1 J505.A3 J505.B1 J505.B3 J506.A1 J506.A3 J506.B1 J506.B3 J507.A1 J507.A3 J507.B1 J507.B3 TP501.P$1
V9P0_DET3: J501.A18 J502.A18 J503.A18 J504.A3 J505.A18 J506.A18 J507.A18 TP502.P$1
VN3P4_DET3: J501.A19 J502.A19 J503.A19 J504.A2 J505.A19 J506.A19 J507.A19 TP503.P$1
VN22_DET3: J501.B20 J502.B20 J503.B20 J504.B1 J504.B2 J505.B20 J506.B20 J507.B20 TP504.P$1
Unconnected: J501.B5 J501.B6 J501.B16 J501.B17 J502.B5 J502.B6 J502.B16 J502.B17 J503.B5 J503.B6 J503.B16 J503.B17 J505.B5 J505.B6 J505.B16 J505.B17 J506.B5 J506.B6 J506.B16 J506.B17 J507.B5 J507.B6 J507.B16 J507.B17

### Notes on the sheet
- Six Layer Detector Adapter Backplane B3
- from Detector Adapter Board | from Control Board
- Alt. Name
  (FPGA)
- Alt. Name
  (FPGA)
- Alt. Name
  (FPGA)
- Alt. Name
  (RP2040)
- DETB_RUN | DETB_STATUS_SELECT
- DETB_END_CYC
- DETB_RUN | DETB_TRIGGER
- UART_FPGA_TO_DETB
- DETB_RESERVED | GPIO06
- DETB_STATUS_SELECT | GPIO05 | UART_DETB_TO_FPGA1 | DETB_SELECT0
- DETB_END_CYC | GPIO04 | DETB_SELECT2 | UART_DETB_TO_FPGA0
- DETB_TRIGGER | GPIO03 | UART_DETB_TO_FPGA2 | DETB_SELECT1
- DETB_SELECT | GPIO02
- UART_FPGA_TO_DETB | GPIO01 | UART_DETB_TO_FPGA4 | DETB_SELECT3
- UART_DETB_TO_FPGA | GPIO00 | DETB_SELECT5 | UART_DETB_TO_FPGA3
- UART_DETB_TO_FPGA5 | DETB_SELECT4
- debugging / testing

## Library data of the parts
J101-J108 J201-J206 J301-J307 J401-J407 J501-J507 = MyLib:M20X2
J109 J308 J408 J508 = MyLib:M05X2: Header M05X2 SMD_0.050: Sullind GRPB052VWQS-RC DigiKey S9012E-05-ND
J110 J111 J509 J510 = MyLib:M04X2
TP101-TP106 TP201-TP205 TP301-TP305 TP401-TP406 TP501-TP504 = MyLib:TESTPOINT